# Altium schematic sheet Version.SchDoc
size 393 x 281 mm; Organization: iMAR GmbH; Address1: Im Reihersbruch 3; Address2: D-66386 St. Ingbert; Address3: www.imar.de; DocumentNumber: 1; SheetNumber: 1; SheetTotal: 7; Abteilung: Entwicklung
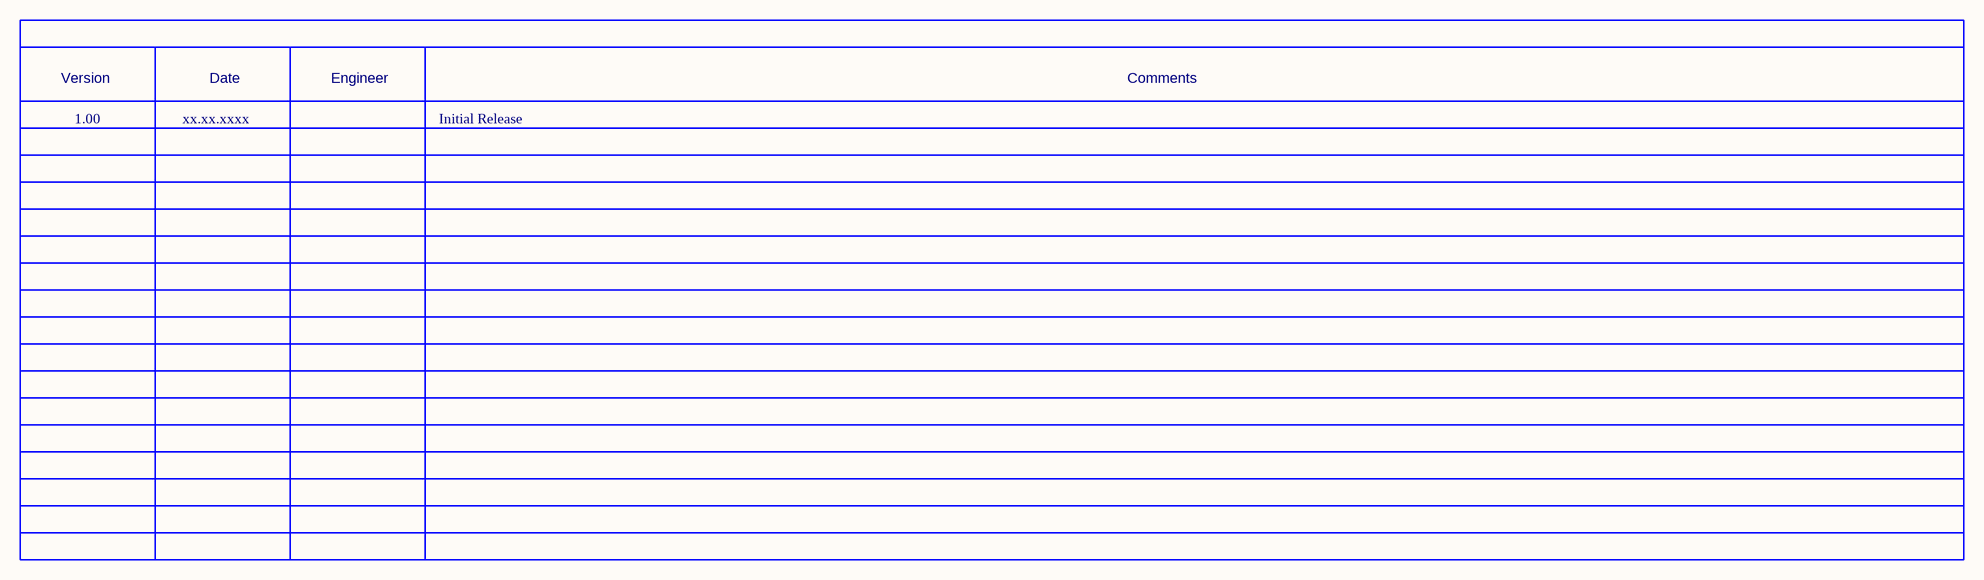
[diagram p0: Version.SchDoc]

## Notes on the sheet
- Version
- 1.00
- xx.xx.xxxx
- Date
- Engineer
- Initial Release
- Comments
- Date/Datum
- Name
- Identification No./Modell Nr.
- Classification/
- Checked
- Approved
- Issued
- Designation/Benennung
- Revision-Character/Versions-Buchstabe
- Verwendungsbereich
- Drawn/Hersteller
- Dept./Abt.
- iMAR Navigation GmbH
- Rev./Ver.
- Drawing No./Zeichnungsnummer
- Sheet/Blatt
- /
- Im Reihersbruch 3
- D-66386 St. Ingbert
- www.imar.de <http://www.imar.de>
- Filename/Dateiname
- Format
- A3